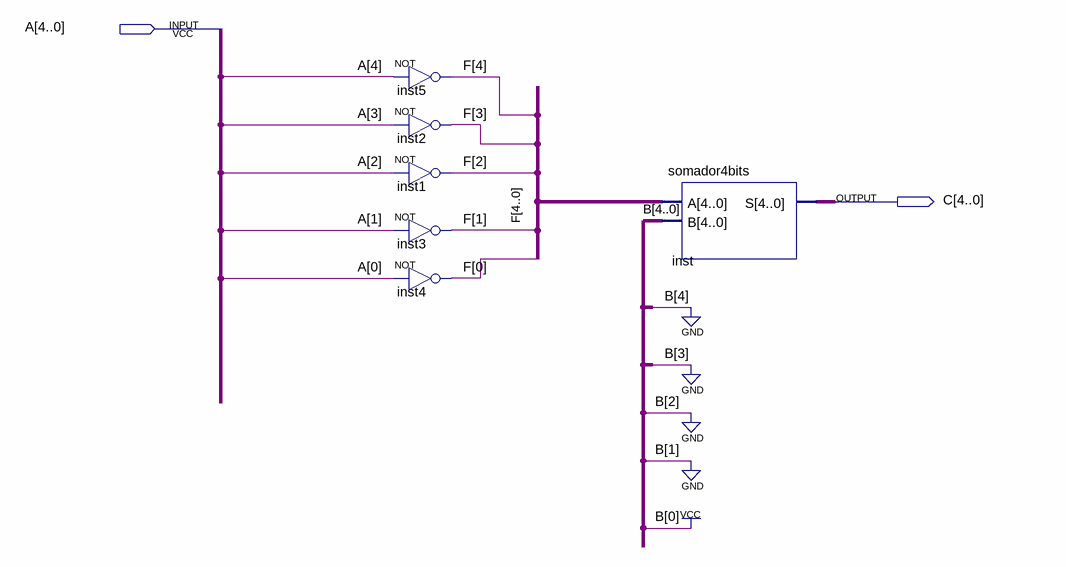
[diagram p0: schematic sheet]
// Quartus schematic Complemento_a2.bdf as structural Verilog: 6 symbols, 2 pins
module Complemento_a2 (
  input  [4:0] A,
  output [4:0] C
);

  wire [4:0] F;

  not inst5 (F[4], A[4]);
  not inst2 (F[3], A[3]);
  not inst1 (F[2], A[2]);
  not inst3 (F[1], A[1]);
  not inst4 (F[0], A[0]);
  somador4bits inst (.A(F), .B(5'b00001), .S(C));
endmodule
